# EAGLE schematic schema_electrica (EAGLE 7.5.0)
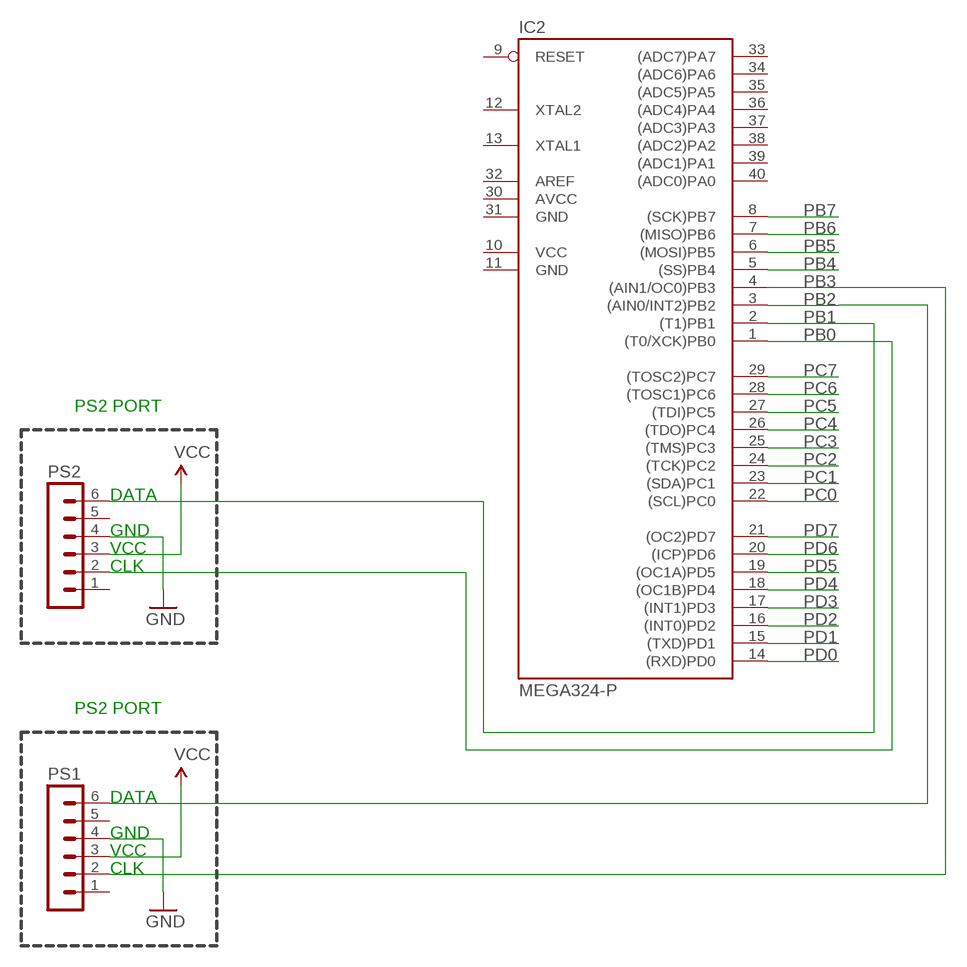
[diagram p0: schematic, sheet 1]

## Parts
IC2  MEGA324-P  MEGA16-P  [DIL40]
PS1  MA06-1  [MA06-1]
PS2  MA06-1  [MA06-1]

## Nets
GND: PS1.4 PS2.4
PB0: IC2.1((T0/XCK)PB0) PS2.2
PB1: IC2.2((T1)PB1) PS2.6
PB2: IC2.3((AIN0/INT2)PB2) PS1.6
PB3: IC2.4((AIN1/OC0)PB3) PS1.2
PB4: IC2.5((SS)PB4)
PB5: IC2.6((MOSI)PB5)
PB6: IC2.7((MISO)PB6)
PB7: IC2.8((SCK)PB7)
PC0: IC2.22((SCL)PC0)
PC1: IC2.23((SDA)PC1)
PC2: IC2.24((TCK)PC2)
PC3: IC2.25((TMS)PC3)
PC4: IC2.26((TDO)PC4)
PC5: IC2.27((TDI)PC5)
PC6: IC2.28((TOSC1)PC6)
PC7: IC2.29((TOSC2)PC7)
PD0: IC2.14((RXD)PD0)
PD1: IC2.15((TXD)PD1)
PD2: IC2.16((INT0)PD2)
PD3: IC2.17((INT1)PD3)
PD4: IC2.18((OC1B)PD4)
PD5: IC2.19((OC1A)PD5)
PD6: IC2.20((ICP)PD6)
PD7: IC2.21((OC2)PD7)
VCC: PS1.3 PS2.3
Unconnected: IC2.9(RESET) IC2.12(XTAL2) IC2.13(XTAL1) IC2.32(AREF) IC2.33((ADC7)PA7) IC2.34((ADC6)PA6) IC2.35((ADC5)PA5) IC2.36((ADC4)PA4) IC2.37((ADC3)PA3) IC2.38((ADC2)PA2) IC2.39((ADC1)PA1) IC2.40((ADC0)PA0) PS1.1 PS1.5 PS2.1 PS2.5

## Notes on the sheet
- PS2 PORT
- DATA
- GND
- VCC
- CLK
- PS2 PORT
- DATA
- GND
- VCC
- CLK

## Power pins joined to a net without a drawn wire
AVCC: IC2.30(AVCC)
GND: IC2.11(GND) IC2.31(GND)
VCC: IC2.10(VCC)

## Library data of the parts
IC2 = atmel:MEGA16-P: MICROCONTROLLER 16 Kbytes FLASH 1 kbytes SRAM 512 bytes EEPROM USART 8-channel 10 bit ADC Source: avr.lbr; MPN: ATMEGA16-16PU; OC_FARNELL: 9171142; OC_NEWARK: 01M6885
PS1 PS2 = con-lstb:MA06-1: PIN HEADER; OC_FARNELL: unknown; OC_NEWARK: unknown